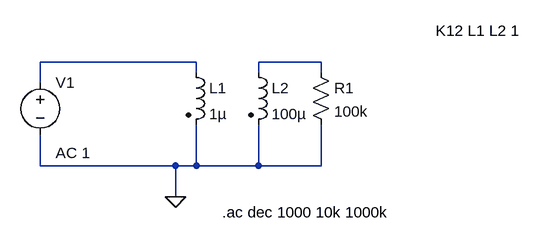
[diagram p0: schematic trafo2.asc]
trafo2.asc, the LTspice schematic file:
Version 4
SHEET 1 880 680
WIRE 176 80 -64 80
WIRE 368 80 272 80
WIRE 176 96 176 80
WIRE 272 96 272 80
WIRE 368 96 368 80
WIRE -64 112 -64 80
WIRE -64 240 -64 192
WIRE 144 240 -64 240
WIRE 176 240 176 176
WIRE 176 240 144 240
WIRE 272 240 272 176
WIRE 272 240 176 240
WIRE 368 240 368 176
WIRE 368 240 272 240
WIRE 144 288 144 240
FLAG 144 288 0
SYMBOL ind2 160 80 R0
SYMATTR InstName L1
SYMATTR Value 1µ
SYMBOL ind2 256 80 R0
SYMATTR InstName L2
SYMATTR Value 100µ
SYMBOL res 352 80 R0
SYMATTR InstName R1
SYMATTR Value 100k
SYMBOL voltage -64 96 R0
WINDOW 123 24 124 Left 2
WINDOW 39 0 0 Left 2
SYMATTR Value2 AC 1
SYMATTR InstName V1
SYMATTR Value ""
TEXT 216 312 Left 2 !.ac dec 1000 10k 1000k
TEXT 544 32 Left 2 !K12 L1 L2 1

The netlist it stands for:
* trafo2.asc
L1 N001 0 1µ
L2 N002 0 100µ
R1 N002 0 100k
V1 N001 0 AC 1
.ac dec 1000 10k 1000k
K12 L1 L2 1
.backanno
.end